# Altium project rp2040_isp_stamp_carrier.PrjPcb
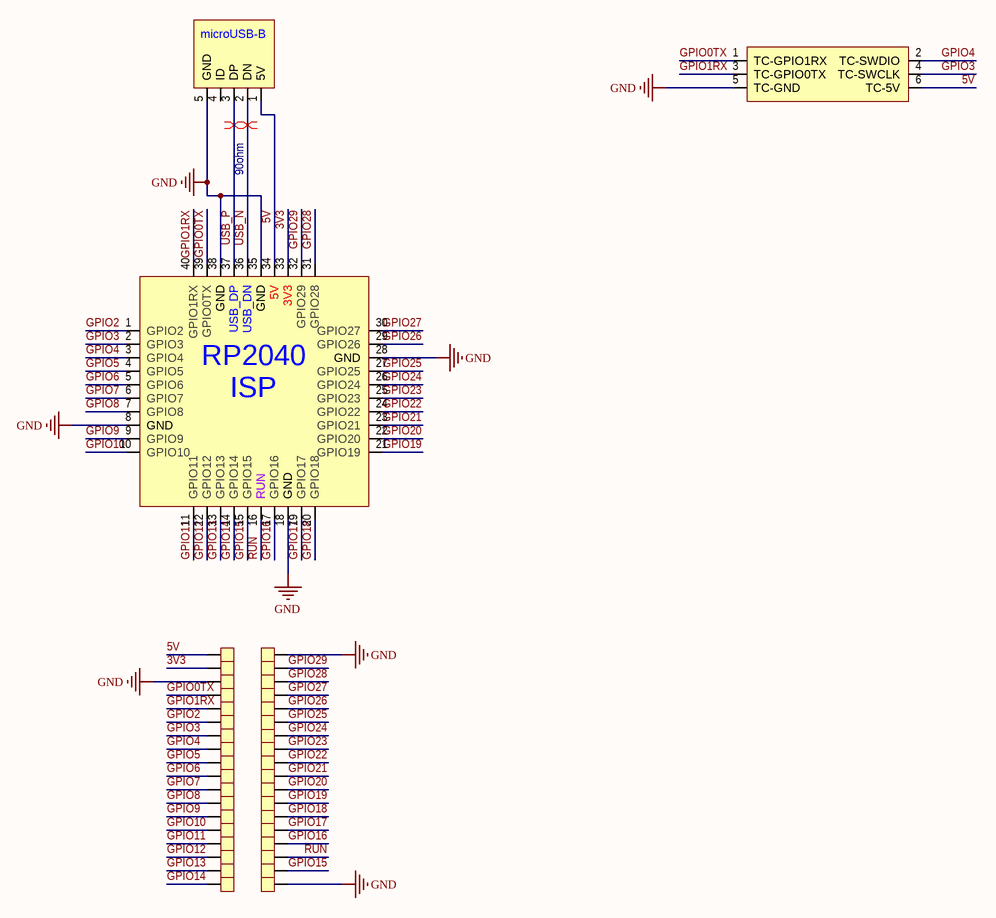
[diagram p0: schematic.SchDoc]
1 sheet, 9 parts. Net scope: global (net labels, ports and power ports of the same name join across sheets).
Board file: pcb.PcbDoc

## Sheet schematic.SchDoc: RP2040 ISP Stamp Carrier
size Letter; SheetNumber: 1; SheetTotal: 1

### Parts
J2  BOX_HEADER  [BOX_HEADER]  (value not drawn)
J4  MICRO_USB_B  [MICRO_USB_B]  (value not drawn)
J5  HEADER  [Header_1x6]  (value not drawn)  (no BOM)
J6  HEADER  [Header_1x6]  (value not drawn)  (no BOM)
J7  HEADER  [Header_1x6]  (value not drawn)  (no BOM)
J8  HEADER  [Header_1x6]  (value not drawn)  (no BOM)
J9  HEADER  [Header_1x6]  (value not drawn)  (no BOM)
J10  HEADER  [Header_1x6]  (value not drawn)  (no BOM)
U1  RP2040_ISP_STAMP  [RP2040_ISP_STAMP]  (value not drawn)  (no BOM)

### Nets
GND: J2.5(TC-GND) J4.5(GND) J5.3 J7.1 J10.6 U1.8(GND) U1.18(GND) U1.28(GND) U1.35(GND) U1.38(GND)
3V3: J5.2 U1.33(3V3)
5V: J2.6(TC-5V) J4.1(5V) J5.1 U1.34(5V)
GPIO0TX: J2.1(TC-GPIO1RX) J5.4 U1.39(GPIO0TX)
GPIO1RX: J2.3(TC-GPIO0TX) J5.5 U1.40(GPIO1RX)
GPIO2: J5.6 U1.1(GPIO2)
GPIO3: J2.4(TC-SWCLK) J6.1 U1.2(GPIO3)
GPIO4: J2.2(TC-SWDIO) J6.2 U1.3(GPIO4)
GPIO5: J6.3 U1.4(GPIO5)
GPIO6: J6.4 U1.5(GPIO6)
GPIO7: J6.5 U1.6(GPIO7)
GPIO8: J6.6 U1.7(GPIO8)
GPIO9: J8.1 U1.9(GPIO9)
GPIO10: J8.2 U1.10(GPIO10)
GPIO11: J8.3 U1.11(GPIO11)
GPIO12: J8.4 U1.12(GPIO12)
GPIO13: J8.5 U1.13(GPIO13)
GPIO14: J8.6 U1.14(GPIO14)
GPIO15: J10.5 U1.15(GPIO15)
GPIO16: J10.3 U1.17(GPIO16)
GPIO17: J10.2 U1.19(GPIO17)
GPIO18: J10.1 U1.20(GPIO18)
GPIO19: J9.6 U1.21(GPIO19)
GPIO20: J9.5 U1.22(GPIO20)
GPIO21: J9.4 U1.23(GPIO21)
GPIO22: J9.3 U1.24(GPIO22)
GPIO23: J9.2 U1.25(GPIO23)
GPIO24: J9.1 U1.26(GPIO24)
GPIO25: J7.6 U1.27(GPIO25)
GPIO26: J7.5 U1.29(GPIO26)
GPIO27: J7.4 U1.30(GPIO27)
GPIO28: J7.3 U1.31(GPIO28)
GPIO29: J7.2 U1.32(GPIO29)
RUN: J10.4 U1.16(RUN)
USB_N: J4.2(DN) U1.36(USB_DN)
USB_P: J4.3(DP) U1.37(USB_DP)

Not connected (* = marked no-connect by the designer): J4 4(ID)

### Layout directives
differential pair; differential pair class 90ohm: USB_N, USB_P

### Notes on the sheet
- Last Modified
- Drawn by Alexander Osborne
- www.osborneee.com <http://www.osborneee.com>
- www.github.com/amosborne <http://www.github.com/amosborne>
- Sheet
- www.linkedin.com/in/alexander-m-osborne/ <http://www.linkedin.com/in/alexander-m-osborne/>
- of
- (in symbol MICRO_USB_B) microUSB-B
- (in symbol RP2040_ISP_STAMP) RP2040 / ISP / STAMP
- (in symbol RP2040) Raspberry Pi

### Library data of the parts
J2 = BOX_HEADER: Connector Header Through Hole 6 position 0.100" (2.54mm); Supplier 1: Digi-Key; Supplier Part Number 1: 732-5394-ND
J4 = MICRO_USB_B: USB - micro B Receptacle Connector 5 Position Board Edge, Cutout; Surface Mount, Right Angle; Supplier 1: Digi-Key; Supplier Part Number 1: WM1398CT-ND